# Altium schematic sheet Connectors.SchDoc
size 594 x 420 mm; PageSetup: Record=PageOptions|CenterHorizontal=True|CenterVertical=True|PrintScale=0.94|XCorrection=1.00|YCorrection=1.00|PrintKind=1|BorderSize=5000000|LeftOffset=0|BottomOffset=0|Orientation=1|PaperLength=1000|PaperWidth=1000|Scale=100|PaperSource=7|PrintQuality=-4|MediaType=1|DitherType=10|PaperKind=A4|PrintScaleMode=1; Address1: Address1; Address2: Address2; Address3: Address3; Address4: Address4; DocumentNumber: 5; SheetNumber: 3; SheetTotal: 4
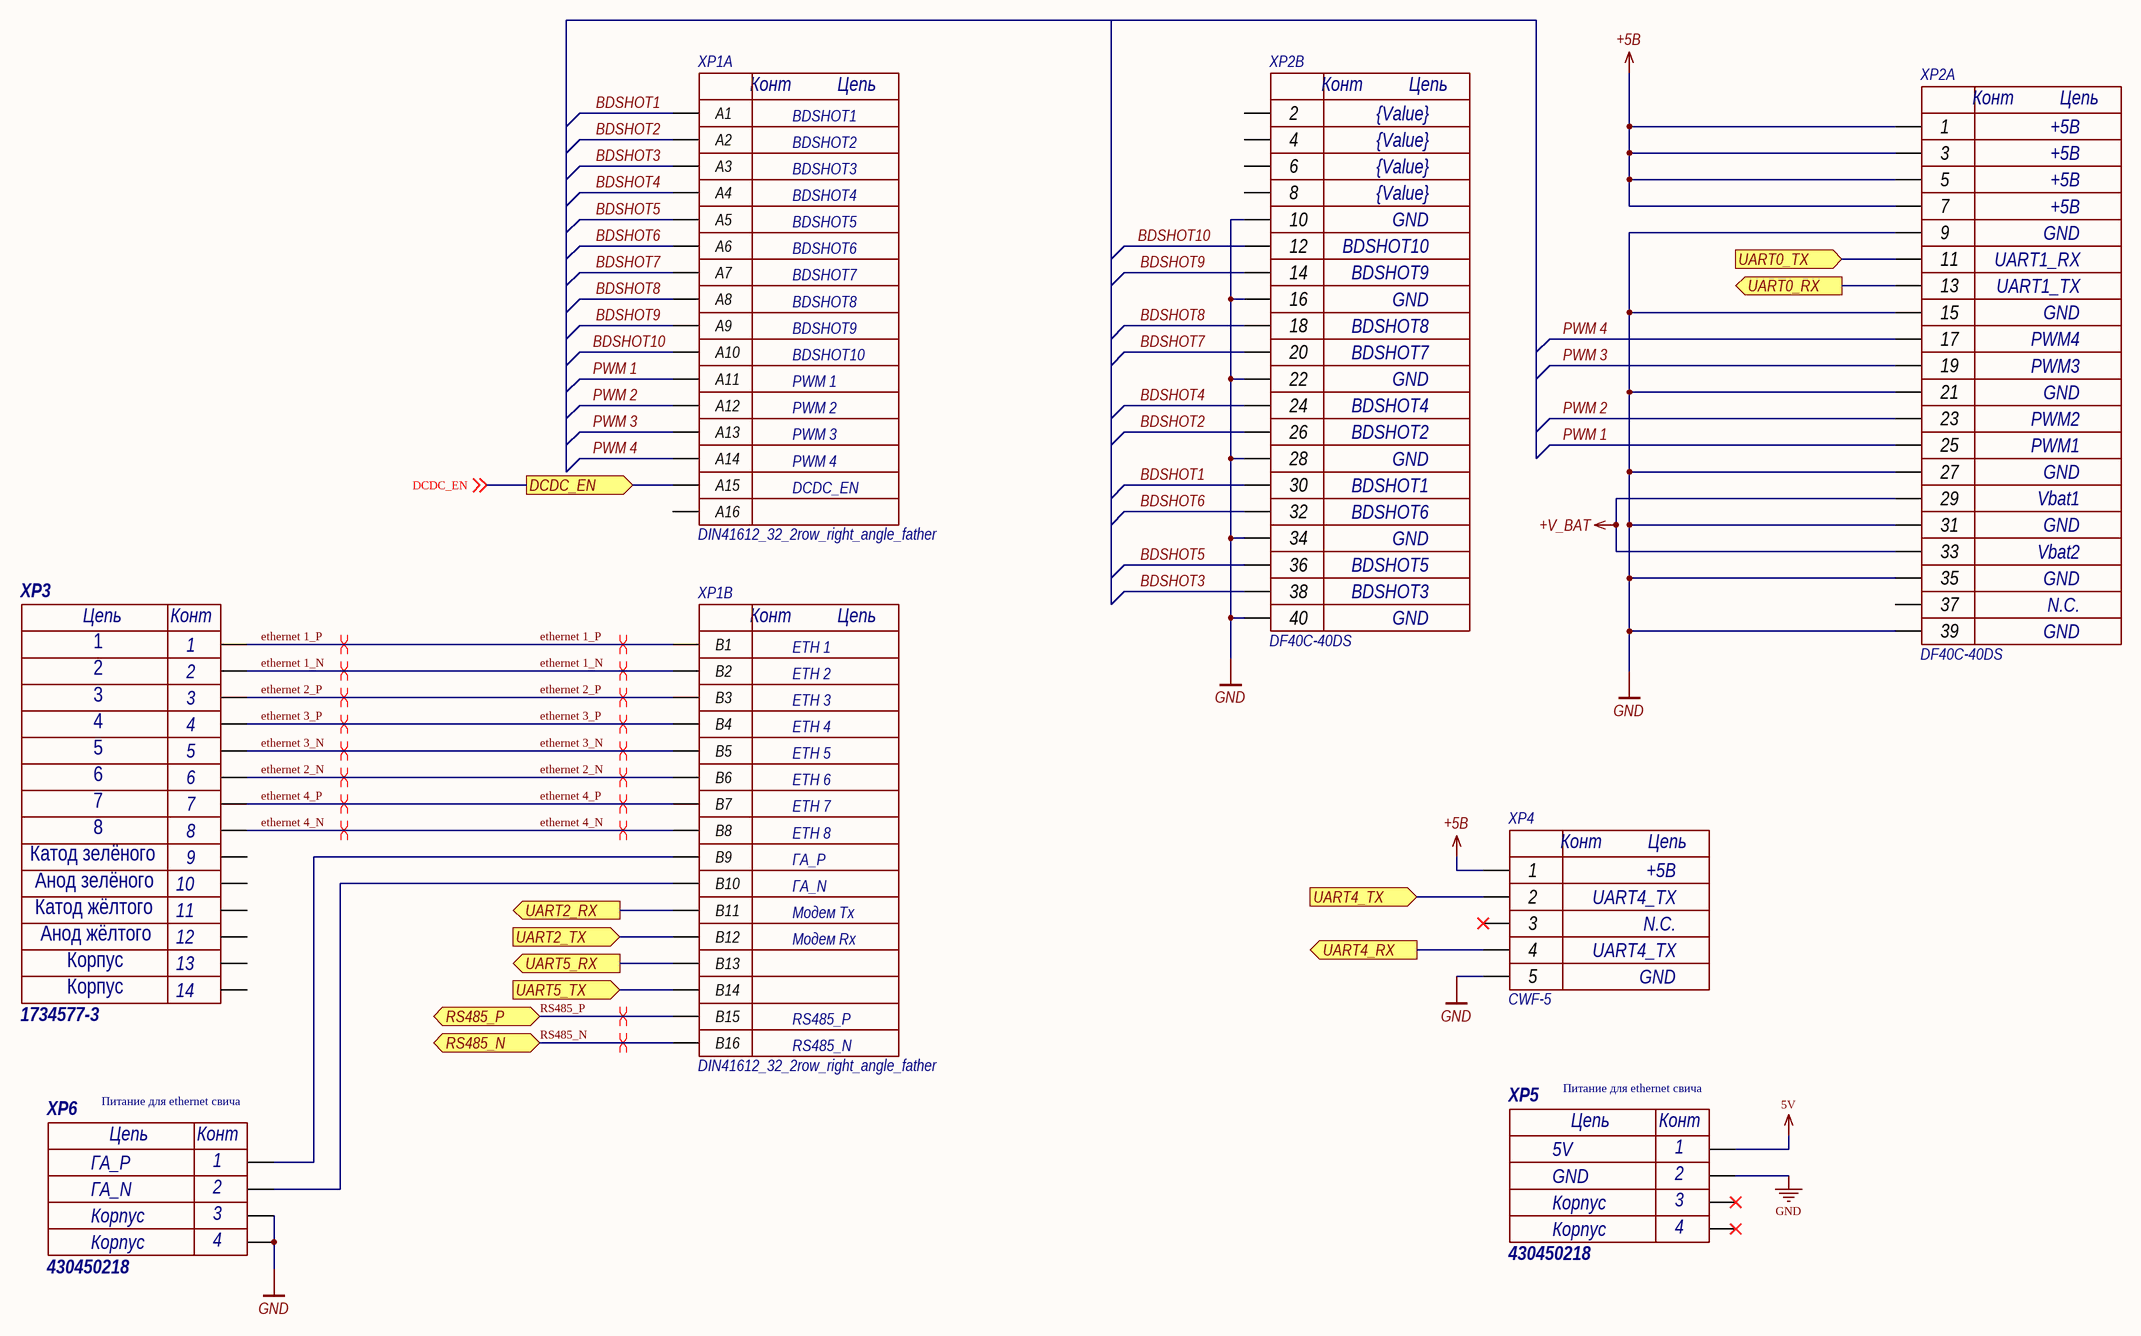
[diagram p0: Connectors.SchDoc]

## Parts
XP1  DIN41612_32_2row_right_angle_father  [DIN41612_32_2row_right_angle_father]  (parts A,B of 2)
XP2  DF40C-40DS  Value17: Vbat2  Value20: GND  Value19: N.C.  Value15: Vbat1  Value13: PWM1  Value12: PWM2  Value10: PWM3  Value9: PWM4  Value7: UART1_TX  Value6: UART1_RX  Value4: +5В  [DF40C-40DS]  (parts A,B of 2)
XP3  1734577-3  [1-1734577-3-rj45-8p8c]
XP4  CWF-5  Value1: +5В  Value2: UART4_TX  Value3: N.C.  Value5: GND  [CWF-5]
XP5  430450218  Value3: Корпус  Value2: GND  Value1: 5V  Parameter 1: Питание для ethernet свича  [Molex_430450218]
XP6  430450218  Value3: Корпус  Value2: ГА_N  Value1: ГА_P  Parameter 1: Питание для ethernet свича  [Molex_430450218]

## Ports
DCDC_EN (out), RS485_N (bidir), RS485_P (bidir), UART0_RX (out), UART0_TX (in), UART2_RX (out), UART2_TX (in), UART4_RX (out), UART4_TX (in), UART5_RX (out), UART5_TX (in)

## Nets
5V: XP5.1
+5В: XP2.1 XP2.3 XP2.5 XP2.7 XP4.1
+V_BAT: XP2.29 XP2.33
GND: XP2.9 XP2.10 XP2.15 XP2.16 XP2.21 XP2.22 XP2.27 XP2.28 XP2.31 XP2.34 XP2.35 XP2.39 XP2.40 XP4.5 XP5.2 XP6.0
BDSHOT1: XP1.A1 XP2.30
BDSHOT2: XP1.A2 XP2.26
BDSHOT3: XP1.A3 XP2.38
BDSHOT4: XP1.A4 XP2.24
BDSHOT5: XP1.A5 XP2.36
BDSHOT6: XP1.A6 XP2.32
BDSHOT7: XP1.A7 XP2.20
BDSHOT8: XP1.A8 XP2.18
BDSHOT9: XP1.A9 XP2.14
BDSHOT10: XP1.A10 XP2.12
DCDC_EN: XP1.A15 ; off-sheet DCDC_EN, port DCDC_EN
ethernet 1_N: XP1.B2 XP3.2
ethernet 1_P: XP1.B1 XP3.1
ethernet 2_N: XP1.B6 XP3.6
ethernet 2_P: XP1.B3 XP3.3
ethernet 3_N: XP1.B5 XP3.5
ethernet 3_P: XP1.B4 XP3.4
ethernet 4_N: XP1.B8 XP3.8
ethernet 4_P: XP1.B7 XP3.7
PWM 1: XP1.A11 XP2.25
PWM 2: XP1.A12 XP2.23
PWM 3: XP1.A13 XP2.19
PWM 4: XP1.A14 XP2.17
RS485_N: XP1.B16 ; port RS485_N
RS485_P: XP1.B15 ; port RS485_P
UART0_RX: XP2.13 ; port UART0_RX
UART0_TX: XP2.11 ; port UART0_TX
UART2_RX: XP1.B11 ; port UART2_RX
UART2_TX: XP1.B12 ; port UART2_TX
UART4_RX: XP4.4 ; port UART4_RX
UART4_TX: XP4.2 ; port UART4_TX
UART5_RX: XP1.B13 ; port UART5_RX
UART5_TX: XP1.B14 ; port UART5_TX
NetXP1_B9: XP1.B9 XP6.1
NetXP1_B10: XP1.B10 XP6.2

Not connected (* = marked no-connect by the designer): XP1 A16; XP2 2 4 6 8 37; XP3 9 10 11 12 MH1 MH2; XP4 3*; XP5 0*

## Layout directives
differential pair: ethernet 1_N, ethernet 1_P, ethernet 2_N, ethernet 2_P, ethernet 3_N, ethernet 3_P, ethernet 4_N, ethernet 4_P, RS485_N, RS485_P

## Notes on the sheet
- BDSHOT1
- BDSHOT2
- BDSHOT3
- BDSHOT4
- BDSHOT5
- BDSHOT6
- BDSHOT7
- BDSHOT8
- BDSHOT9
- BDSHOT10
- PWM 1
- PWM 2
- PWM 3
- PWM 4
- DCDC_EN
- ETH 1
- ETH 2
- ETH 3
- ETH 4
- ETH 5
- ETH 6
- ETH 7
- ETH 8
- ГА_P
- ГА_N
- Модем Tx
- Модем Rx
- RS485_P
- RS485_N
- Перв. примен.
- Справ. №
- Подп. и дата
- Инв. № дубл.
- Взам. инв. №
- Инв. № подл.
- Изм.
- Лист
- № докум.
- Подп.
- Дата
- Копировал
- Формат А2
- (in symbol 1-1734577-3-rj45-8p8c) Цепь; Конт; Катод зелёного; Анод зелёного; Катод жёлтого; Анод жёлтого; Корпус; 13; 14
- (in symbol CWF-5) Конт; Цепь
- (in symbol DF40C-40DS, part A) Конт; Цепь
- (in symbol DF40C-40DS, part B) Конт; Цепь
- (in symbol DIN41612_32_2row_right_angle_father, part A) Конт; Цепь
- (in symbol DIN41612_32_2row_right_angle_father, part B) Конт; Цепь
- (in symbol Molex_430450218) Цепь; Конт; 3; 4

## Library data of the parts
XP1 = DIN41612_32_2row_right_angle_father: DIN41612R (DS1118-32M0R23), Разъем (вилка) тип B 32pin (2х16), шаг 2.54мм двухрядный угловой (ряд АВ); Part Number: DIN41612_32_2row_right_angle_father
XP2 = DF40C-40DS: Разъем плата-плата 40 пинов, папа, шаг 0.4мм; System: Connector; Value18: GND; Value16: GND; Value14: GND; Value11: GND; Value8: GND; Value5: GND; Value3: +5В; Value2: +5В; Value1: +5В; Part Number: DF40C-40DS
XP3 = 1-1734577-3-rj45-8p8c: Модульный разъем, Cat3, RJ45, Гнездо, 8 контакт(-ов), 8 вывод(-ов), 1 порт(-ов); Part Number: 1-1734577-3-rj45-8p8c
XP4 = CWF-5: 5-пиновый разъем с ключом; System: Connector; Value4: UART4_TX; Part Number: CWF-5
XP5 XP6 = Molex_430450218: Разъем типа провод-плата, 3 мм, 2 контакт(-ов), Штыревой Разъем, Серия Micro-Fit для поверхностного монтажа; Value4: Корпус; Part Number: Molex_430450218